# EAGLE design at32 (EAGLE 8.2.1)
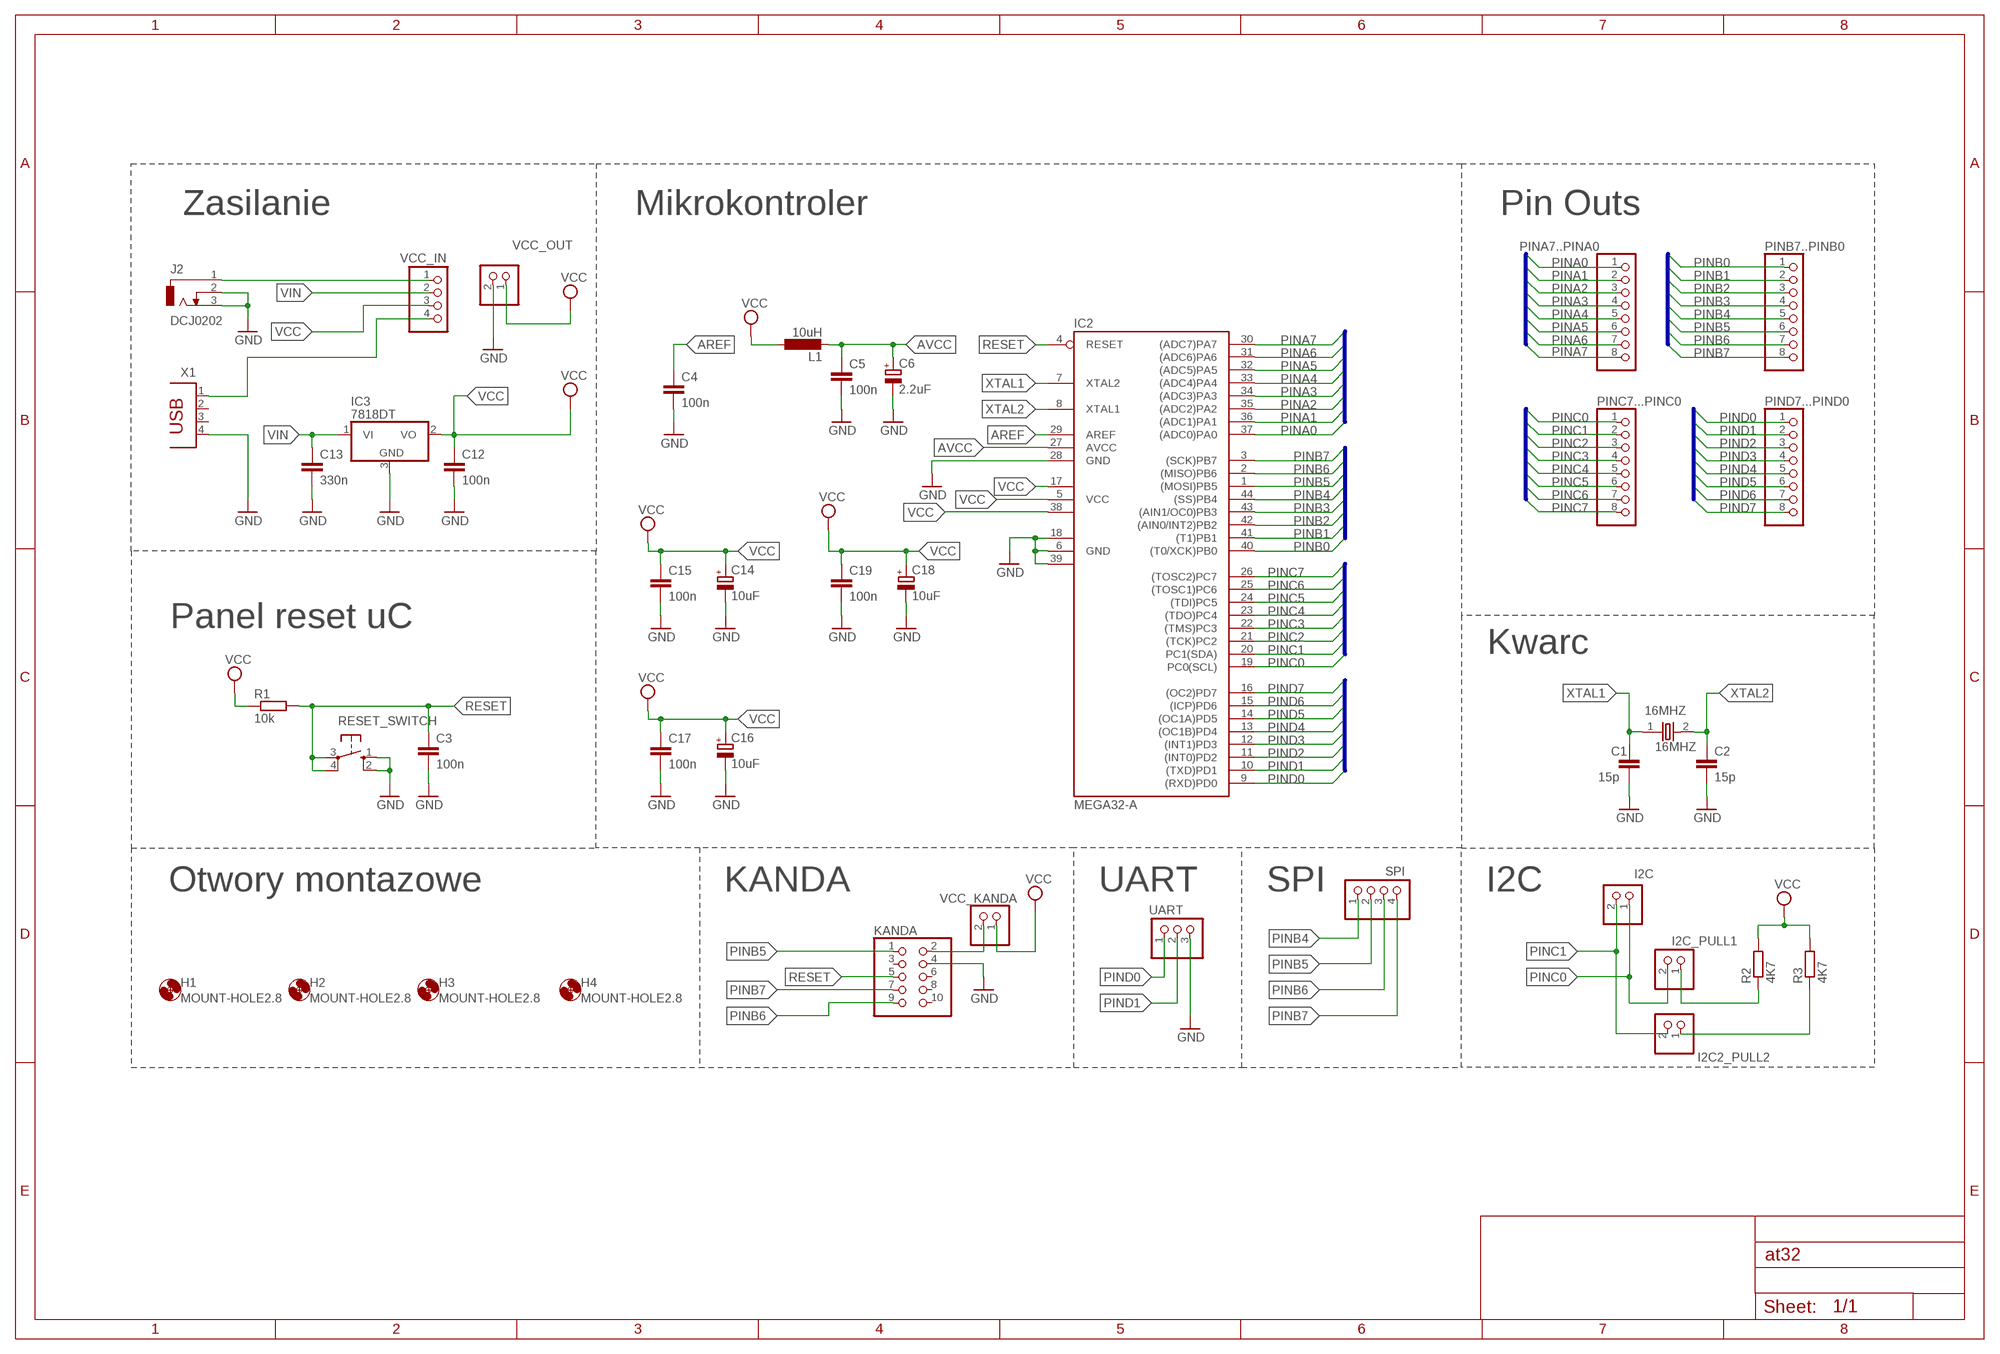
[diagram p0: schematic, sheet 1]

## Parts
16MHZ  16MHZ  [HC49SM]
C1  15p  C-EUC1206K  [C1206K]
C2  15p  C-EUC1206K  [C1206K]
C3  100n  C-EUC1206K  [C1206K]
C4  100n  C-EUC1206K  [C1206K]
C5  100n  C-EUC1206K  [C1206K]
C6  2.2uF  CPOL-EUA/3216-18W  [A/3216-18W]
C12  100n  C-EUC1206K  [C1206K]
C13  330n  C-EUC1206K  [C1206K]
C14  10uF  CPOL-EUA/3216-18W  [A/3216-18W]
C15  100n  C-EUC1206K  [C1206K]
C16  10uF  CPOL-EUA/3216-18W  [A/3216-18W]
C17  100n  C-EUC1206K  [C1206K]
C18  10uF  CPOL-EUA/3216-18W  [A/3216-18W]
C19  100n  C-EUC1206K  [C1206K]
H1  MOUNT-HOLE2.8  [2,8]
H2  MOUNT-HOLE2.8  [2,8]
H3  MOUNT-HOLE2.8  [2,8]
H4  MOUNT-HOLE2.8  [2,8]
I2C  PINHD-1X2  [1X02]
I2C2_PULL2  PINHD-1X2  [1X02]
I2C_PULL1  PINHD-1X2  [1X02]
IC2  MEGA32-A  [TQFP44]
IC3  7818DT  [TO252]
J2  DCJ0202  [DCJ0202]
KANDA  PINHD-2X5  [2X05]
L1  10uH  L-EUL3225M  [L3225M]
PINA7..PINA0  PINHD-1X8MAT8  [1X08]
PINB7..PINB0  PINHD-1X8MAT8  [1X08]
PINC7...PINC0  PINHD-1X8MAT8  [1X08]
PIND7...PIND0  PINHD-1X8MAT8  [1X08]
R1  10k  R-EU_R3216  [R3216]
R2  4K7  R-EU_R3216  [R3216]
R3  4K7  R-EU_R3216  [R3216]
RESET_SWITCH  10-XX  [B3F-10XX]
SPI  PINHD-1X4  [1X04]
UART  PINHD-1X3  [1X03]
VCC_IN  PINHD-1X4  [1X04]
VCC_KANDA  PINHD-1X2  [1X02]
VCC_OUT  PINHD-1X2  [1X02]
X1  PN87520  [PN87520]

## Nets
AREF: C4.1 IC2.29(AREF)
AVCC: C5.1 C6.+ IC2.27(AVCC) L1.2
GND: C1.2 C2.2 C3.2 C4.2 C5.2 C6.- C12.2 C13.2 C14.- C15.2 C16.- C17.2 C18.- C19.2 IC2.6(GND) IC2.18(GND1) IC2.28(GND) IC2.39(GND2) IC3.3(GND) J2.2 J2.3 KANDA.4 RESET_SWITCH.1(S) RESET_SWITCH.2(S1) UART.3 VCC_OUT.2 X1.4
N$1: I2C2_PULL2.1 R3.1
N$3: J2.1 VCC_IN.1
N$7: I2C_PULL1.1 R2.1
N$9: VCC_IN.4 X1.1
N$42: KANDA.2 VCC_KANDA.2
PINA0: IC2.37((ADC0)PA0) PINA7..PINA0.1
PINA1: IC2.36((ADC1)PA1) PINA7..PINA0.2
PINA2: IC2.35((ADC2)PA2) PINA7..PINA0.3
PINA3: IC2.34((ADC3)PA3) PINA7..PINA0.4
PINA4: IC2.33((ADC4)PA4) PINA7..PINA0.5
PINA5: IC2.32((ADC5)PA5) PINA7..PINA0.6
PINA6: IC2.31((ADC6)PA6) PINA7..PINA0.7
PINA7: IC2.30((ADC7)PA7) PINA7..PINA0.8
PINB0: IC2.40((T0/XCK)PB0) PINB7..PINB0.1
PINB1: IC2.41((T1)PB1) PINB7..PINB0.2
PINB2: IC2.42((AIN0/INT2)PB2) PINB7..PINB0.3
PINB3: IC2.43((AIN1/OC0)PB3) PINB7..PINB0.4
PINB4: IC2.44((SS)PB4) PINB7..PINB0.5 SPI.1
PINB5: IC2.1((MOSI)PB5) KANDA.1 PINB7..PINB0.6 SPI.2
PINB6: IC2.2((MISO)PB6) KANDA.9 PINB7..PINB0.7 SPI.3
PINB7: IC2.3((SCK)PB7) KANDA.7 PINB7..PINB0.8 SPI.4
PINC0: I2C.1 I2C_PULL1.2 IC2.19(PC0(SCL)) PINC7...PINC0.1
PINC1: I2C2_PULL2.2 I2C.2 IC2.20(PC1(SDA)) PINC7...PINC0.2
PINC2: IC2.21((TCK)PC2) PINC7...PINC0.3
PINC3: IC2.22((TMS)PC3) PINC7...PINC0.4
PINC4: IC2.23((TDO)PC4) PINC7...PINC0.5
PINC5: IC2.24((TDI)PC5) PINC7...PINC0.6
PINC6: IC2.25((TOSC1)PC6) PINC7...PINC0.7
PINC7: IC2.26((TOSC2)PC7) PINC7...PINC0.8
PIND0: IC2.9((RXD)PD0) PIND7...PIND0.1 UART.1
PIND1: IC2.10((TXD)PD1) PIND7...PIND0.2 UART.2
PIND2: IC2.11((INT0)PD2) PIND7...PIND0.3
PIND3: IC2.12((INT1)PD3) PIND7...PIND0.4
PIND4: IC2.13((OC1B)PD4) PIND7...PIND0.5
PIND5: IC2.14((OC1A)PD5) PIND7...PIND0.6
PIND6: IC2.15((ICP)PD6) PIND7...PIND0.7
PIND7: IC2.16((OC2)PD7) PIND7...PIND0.8
RESET: C3.1 IC2.4(RESET) KANDA.5 R1.2 RESET_SWITCH.3(P) RESET_SWITCH.4(P1)
VCC: C12.1 C14.+ C15.1 C16.+ C17.1 C18.+ C19.1 IC2.5(VCC) IC2.17(VCC1) IC2.38(VCC2) IC3.2(VO) L1.1 R1.1 R2.2 R3.2 VCC_IN.3 VCC_KANDA.1 VCC_OUT.1
VIN: C13.1 IC3.1(VI) VCC_IN.2
XTAL1: 16MHZ.1 C1.1 IC2.7(XTAL2)
XTAL2: 16MHZ.2 C2.1 IC2.8(XTAL1)
Unconnected: KANDA.3 KANDA.6 KANDA.8 KANDA.10 X1.2 X1.3

## Buses
PINB[0..7]
PINA[0..7]
PINC[0..7]
PIND[0..7]

## Notes on the sheet
- Zasilanie | Mikrokontroler | Pin Outs
- Panel reset uC
- Kwarc
- Otwory montazowe | KANDA | UART | SPI | I2C

## Library data of the parts
16MHZ = Inzynierka:16MHZ
C1-C5 C12 C13 C15 C17 C19 = rcl:C-EU: CAPACITOR, European symbol
C6 C14 C16 C18 = rcl:CPOL-EU: POLARIZED CAPACITOR, European symbol
H1-H4 = holes:MOUNT-HOLE: MOUNTING HOLE with drill center marker
I2C I2C2_PULL2 I2C_PULL1 VCC_KANDA VCC_OUT = pinheadMateusz_popr:PINHD-1X2: PIN HEADER
IC2 = atmel:MEGA32: MICROCONTROLLER 32 Kbytes FLASH 2 Kbytes SRAM 1 Kbytes EEPROM USART 8-channel 10 bit ADC Source: www.atmel.com .. doc2503.pdf; MPN: ATMEGA32-16AU; OC_FARNELL: 9171274; OC_NEWARK: 69K6677
IC3 = linear:78*: Positive VOLTAGE REGULATOR Source: http://cache.national.com/ds/LM/LM78L05.pdf http://www.fairchildsemi.com/ds/LM/LM7805.pdf
J2 = con-jackMAT:DCJ0202: DC POWER JACK Source: DCJ0202.pdf; OC_FARNELL: unknown; OC_NEWARK: unknown
KANDA = pinhead:PINHD-2X5: PIN HEADER
L1 = rcl:L-EU: INDUCTOR, European symbol
PINA7..PINA0 PINB7..PINB0 PINC7...PINC0 PIND7...PIND0 = pinheadMateusz_popr:PINHD-1X8: PIN HEADER
R1-R3 = rcl:R-EU_: RESISTOR, European symbol
RESET_SWITCH = switch-omron:10-XX: OMRON SWITCH; MPN: B3F-1000; OC_FARNELL: 176432; OC_NEWARK: 36M3542
SPI VCC_IN = pinheadMateusz_popr:PINHD-1X4: PIN HEADER
UART = pinheadMateusz_popr:PINHD-1X3: PIN HEADER
X1 = con-berg_poprw:PN87520: BERG USB connector; OC_FARNELL: unknown; OC_NEWARK: unknown

## Board
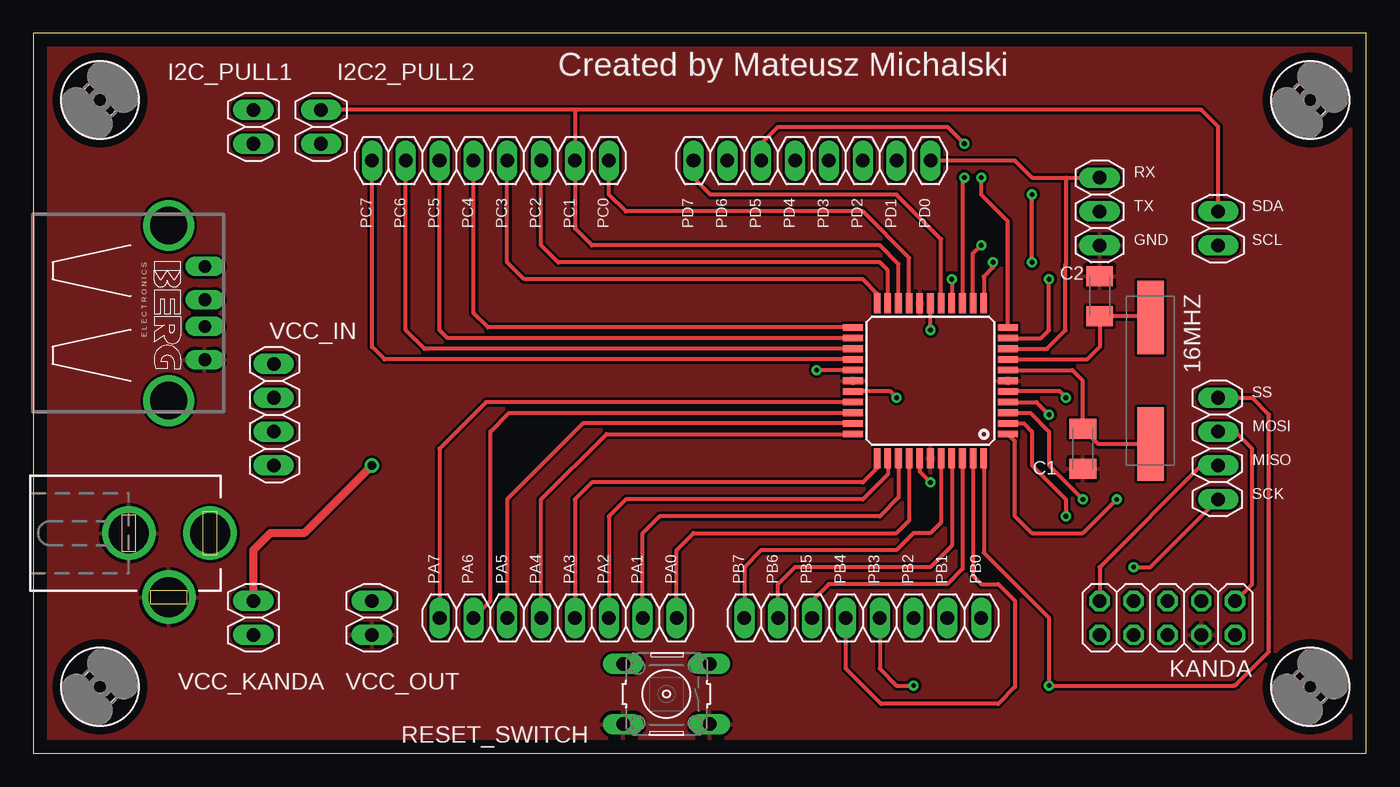
[diagram p1: board, top side]
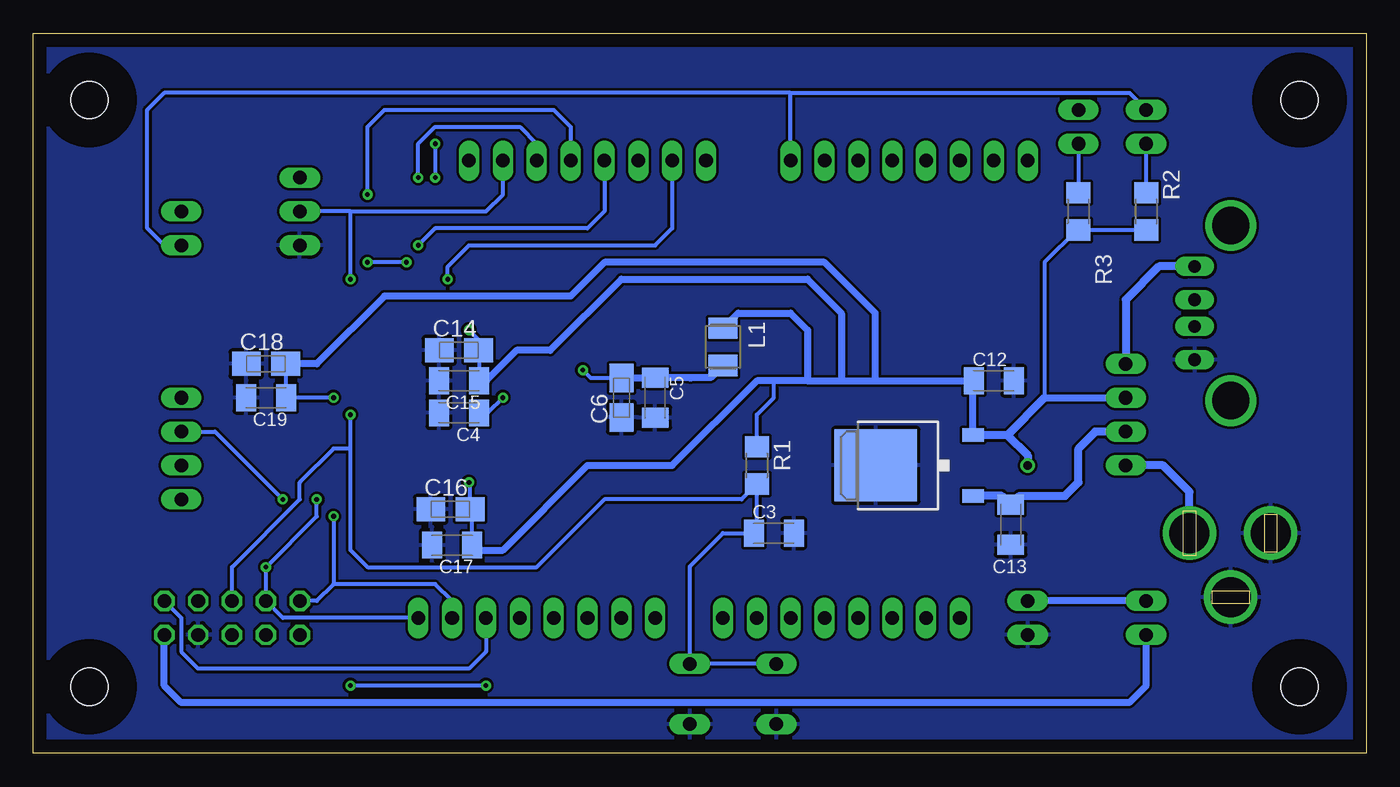
[diagram p2: board, bottom side, seen from below]

Size 100 x 54 mm. Coordinates in mm from the lower left corner, seen from the top.
Outline: 0,0 100,0 100,54 0,54 0,0
Copper layers (1*16): Top 0.035mm / dielectric 1.5mm / Bottom 0.035mm
Design rules "default *": minimum track width 8mil, minimum drill 0.35mm, track to track 8mil, track to pad 8mil, pad to pad 8mil, via to via 8mil, smd to smd 8mil, copper to edge 40mil, drill to drill 8mil, minimum pad ring 10mil, minimum via ring 8mil, stop-mask expansion 8mil, vias tented up to drill 0mil, thermal gap 10mil

### Footprints (pad centres in the part's own frame; a part is rotated, then mirrored left to right if it is on the bottom)
HC49SM = smd 5.5 x 2: 1 -4.75,0; 2 4.75,0
C1206K = smd 1.5 x 2: 1 -1.5,0; 2 1.5,0
A/3216-18W = smd 2.15 x 1.8: + 1.475,0; - -1.475,0
2,8 = hole 2.8: 0,0
1X02 = drill 1.016 long: 1 -1.27,0; 2 1.27,0
TQFP44 = smd 1.5 x 0.5: 1 -5.8,4; 2 -5.8,3.2; 3 -5.8,2.4; 4 -5.8,1.6; 5 -5.8,0.8; 6 -5.8,0; 7 -5.8,-0.8; 8 -5.8,-1.6; 9 -5.8,-2.4; 10 -5.8,-3.2; 11 -5.8,-4; 23 5.8,-4; 24 5.8,-3.2; 25 5.8,-2.4; 26 5.8,-1.6; 27 5.8,-0.8; 28 5.8,0; 29 5.8,0.8; 30 5.8,1.6; 31 5.8,2.4; 32 5.8,3.2; 33 5.8,4 | smd 0.5 x 1.5: 12 -4,-5.8; 13 -3.2,-5.8; 14 -2.4,-5.8; 15 -1.6,-5.8; 16 -0.8,-5.8; 17 0,-5.8; 18 0.8,-5.8; 19 1.6,-5.8; 20 2.4,-5.8; 21 3.2,-5.8; 22 4,-5.8; 34 4,5.8; 35 3.2,5.8; 36 2.4,5.8; 37 1.6,5.8; 38 0.8,5.8; 39 0,5.8; 40 -0.8,5.8; 41 -1.6,5.8; 42 -2.4,5.8; 43 -3.2,5.8; 44 -4,5.8
TO252 = smd 1 x 1.6: 1 -2.28,-4.8; 2 2.28,-4.8 | smd 5.4 x 6.2: 3 0,2.5
DCJ0202 = drill 3 pad 3.81: 1 0,3.1; 2 4.8,0; 3 0,-3
2X05 = drill 1.016 octagon: 1 -5.08,-1.27; 2 -5.08,1.27; 3 -2.54,-1.27; 4 -2.54,1.27; 5 0,-1.27; 6 0,1.27; 7 2.54,-1.27; 8 2.54,1.27; 9 5.08,-1.27; 10 5.08,1.27
L3225M = smd 1.6 x 2.2: 1 -1.4,0; 2 1.4,0
1X08 = drill 1.016 long: 1 -8.89,0; 2 -6.35,0; 3 -3.81,0; 4 -1.27,0; 5 1.27,0; 6 3.81,0; 7 6.35,0; 8 8.89,0
R3216 = smd 1.6 x 1.8: 1 -1.4,0; 2 1.4,0
B3F-10XX = drill 1.016 long: 1 -3.251,2.261; 2 3.251,2.261; 3 -3.251,-2.261; 4 3.251,-2.261
1X04 = drill 1.016 long: 1 -3.81,0; 2 -1.27,0; 3 1.27,0; 4 3.81,0
1X03 = drill 1.016 long: 1 -2.54,0; 2 0,0; 3 2.54,0
PN87520 = drill 0.95 long: 1 -3.5,2.71; 2 -1,2.71; 3 1,2.71; 4 3.5,2.71 | drill 2.8 pad 3.5: P$1 6.57,0; P$2 -6.57,0

### Placement (x,y rotation side)
16MHZ  83.82,27.94 90 top
C1  78.74,22.86 270 top
C2  80.01,34.29 90 top
C3  44.45,16.51 0 bottom
C4  68.07,25.53 180 bottom
C5  53.34,26.67 270 bottom
C6  55.88,26.67 90 bottom
C12  27.94,27.94 0 bottom
C13  26.67,17.14 270 bottom
C14  68.07,30.23 0 bottom
C15  68.07,27.94 180 bottom
C16  68.71,18.29 0 bottom
C17  68.58,15.62 180 bottom
C18  82.55,29.21 0 bottom
C19  82.55,26.67 180 bottom
H1  95.8,5 0 top
H2  95.8,49 0 top
H3  5,49 0 top
H4  5,5 0 top
I2C  88.9,39.37 90 top
I2C2_PULL2  21.59,46.99 90 top
I2C_PULL1  16.51,46.99 90 top
IC2  67.31,27.94 180 top
IC3  34.29,21.59 90 bottom
J2  10.16,16.51 270 top
KANDA  85.09,10.16 180 top
L1  48.26,30.48 270 bottom
PINA7..PINA0  39.37,10.16 180 top
PINB7..PINB0  62.23,10.16 0 top
PINC7...PINC0  34.29,44.45 180 top
PIND7...PIND0  58.42,44.45 180 top
R1  45.72,21.59 270 bottom
R2  16.51,40.64 270 bottom
R3  21.59,40.64 270 bottom
RESET_SWITCH  47.5,4.45 180 top
SPI  88.9,22.86 270 top
UART  80.01,40.64 270 top
VCC_IN  18.03,25.4 90 top
VCC_KANDA  16.51,10.16 270 top
VCC_OUT  25.4,10.16 270 top
X1  10.16,33.02 270 top

### Tracks (layer width: path | path; a pad name or v marks a point on that pad's centre or on a via)
AREF  (via drill 0.35)
  Top 0.305: v64.77,26.67 64.3,27.14 IC2.29
  Bottom 0.305: v64.77,26.67 65.91,25.53 C4.1
AVCC  (via drill 0.35)
  Top 0.305: IC2.27 v58.76,28.74
  Bottom 0.305: C6.+ 58.17,28.14 v58.76,28.74
  Bottom 0.508: C6.+ 55.85,28.17 C5.1 50.8,28.17 | 50.8,28.17 50.57,28.17 | L1.2 49.17,28.17 50.8,28.17
GND
  pour Top: -3.81,55.88 105.41,55.88 105.41,-6.35 -3.81,-6.35
  pour Bottom: -1.27,57.15 104.14,57.15 104.14,-5.08 -3.81,-5.08 -3.81,57.15
N$1
  Bottom 0.305: 21.72,42.04 R3.1 I2C2_PULL2.1
N$3
  Bottom 0.61: VCC_IN.1 15.24,21.59 13.26,19.61 J2.1
N$7
  Bottom 0.305: R2.1 I2C_PULL1.1
N$9
  Bottom 0.61: VCC_IN.4 18.03,34.04 15.55,36.52 X1.1
N$42
  Bottom 0.508: VCC_KANDA.2 16.51,5.08 17.78,3.81 88.9,3.81 90.17,5.08 KANDA.2
PINA0
  Top 0.305: IC2.37 65.71,17.45 64.77,16.51 49.53,16.51 48.26,15.24 PINA7..PINA0.1
PINA1
  Top 0.305: PINA7..PINA0.2 45.72,16.51 46.99,17.78 63.5,17.78 64.91,19.19 IC2.36
PINA2
  Top 0.305: IC2.35 64.11,20.93 62.23,19.05 44.45,19.05 43.18,17.78 PINA7..PINA0.3
PINA3
  Top 0.305: IC2.34 63.31,21.4 62.23,20.32 41.91,20.32 40.64,19.05 PINA7..PINA0.4
PINA4
  Top 0.305: PINA7..PINA0.5 38.1,19.05 42.99,23.94 IC2.33
PINA5
  Top 0.305: IC2.32 41.25,24.74 35.56,19.05 PINA7..PINA0.6
PINA6
  Top 0.305: PINA7..PINA0.7 34.29,11.43 34.29,24.13 35.7,25.54 IC2.31
PINA7
  Top 0.305: PINA7..PINA0.8 30.48,22.86 33.96,26.34 IC2.30
PINB0
  Top 0.305: 53.34,11.43 PINB7..PINB0.1 53.34,13.97 54.61,15.24 64.77,15.24 66.04,16.51 67.31,16.51 68.11,17.31 IC2.40
PINB1
  Top 0.305: PINB7..PINB0.2 55.88,12.7 57.15,13.97 67.31,13.97 68.91,15.57 IC2.41
PINB2
  Top 0.305: PINB7..PINB0.3 58.42,11.43 59.69,12.7 68.58,12.7 69.71,13.83 IC2.42
PINB3
  Top 0.305: IC2.43 70.51,13.31 71.12,12.7 72.39,12.7 73.66,11.43 73.66,4.98 72.39,3.71 63.6,3.71 60.96,6.35 PINB7..PINB0.4
PINB4  (via drill 0.35)
  Top 0.305: SPI.1 91.44,26.67 92.71,25.4 92.71,10.16 92.71,7.62 90.26,5.17 arc-45 90.04,5.08 v76.2,5.08 76.2,10.16 71.31,15.05 IC2.44 | 63.5,8.89 PINB7..PINB0.5 63.5,6.35 64.77,5.08 v66.04,5.08
  Bottom 0.305: v66.04,5.08 v76.2,5.08
PINB5  (via drill 0.35)
  Top 0.305: v81.28,19.05 78.74,16.51 74.93,16.51 73.66,17.78 73.66,23.39 IC2.1 | SPI.2 90.17,24.13 91.44,22.86 91.44,12.7 KANDA.1
  Bottom 0.305: SPI.2 86.36,24.13 v81.28,19.05 | PINB7..PINB0.6 66.04,7.62 67.31,6.35 87.63,6.35 88.9,7.62 88.9,10.16 KANDA.1
PINB6  (via drill 0.35)
  Top 0.305: KANDA.9 80.01,13.97 87.63,21.59 SPI.3 | IC2.2 74.32,24.74 74.93,24.13 74.93,21.59 77.47,19.05 v77.47,17.78
  Bottom 0.305: PINB7..PINB0.7 68.58,11.43 69.85,12.7 77.47,12.7 | KANDA.9 78.74,11.43 77.47,12.7 | v77.47,17.78 77.47,12.7
PINB7  (via drill 0.35)
  Top 0.305: IC2.3 74.79,25.54 76.2,24.13 76.2,21.59 v78.74,19.05 | v82.55,13.97 83.82,13.97 SPI.4
  Bottom 0.305: v78.74,19.05 78.74,17.78 v82.55,13.97 KANDA.7 81.28,10.16 PINB7..PINB0.8
PINC0
  Top 0.305: IC2.19 65.71,37.16 62.23,40.64 44.45,40.64 43.18,41.91 PINC7...PINC0.1
  Bottom 0.305: I2C.1 90.17,38.1 91.44,39.37 91.44,48.26 90.17,49.53 43.18,49.53 | 43.18,49.53 17.78,49.53 I2C_PULL1.2 | PINC7...PINC0.1 43.18,49.53
PINC1
  Top 0.305: IC2.20 64.91,36.69 63.5,38.1 41.91,38.1 40.64,39.37 PINC7...PINC0.2 40.64,48.26 | 40.64,48.26 I2C2_PULL2.2 | I2C.2 88.9,46.99 87.63,48.26 40.64,48.26
PINC2
  Top 0.305: IC2.21 64.11,36.22 63.5,36.83 39.37,36.83 38.1,38.1 PINC7...PINC0.3
PINC3
  Top 0.305: IC2.22 63.31,34.48 62.23,35.56 36.83,35.56 35.56,36.83 PINC7...PINC0.4
PINC4
  Top 0.305: IC2.23 34.1,31.94 33.02,33.02 PINC7...PINC0.5
PINC5
  Top 0.305: IC2.24 31.09,31.14 30.48,31.75 PINC7...PINC0.6
PINC6
  Top 0.305: IC2.25 29.35,30.34 27.94,31.75 PINC7...PINC0.7
PINC7
  Top 0.305: IC2.26 26.34,29.54 25.4,30.48 PINC7...PINC0.8
PIND0
  Top 0.305: 77.47,43.18 74.93,43.18 73.66,44.45 PIND7...PIND0.1 | 77.47,43.18 UART.1 | 77.47,43.18 77.47,36.7 77.44,36.67 77.44,31.71 76.06,30.34 IC2.9
PIND1  (via drill 0.35)
  Top 0.305: IC2.10 75.59,31.14 76.2,31.75 v76.2,35.56
  Bottom 0.305: 76.2,40.64 66.04,40.64 64.77,41.91 PIND7...PIND0.2 | 76.2,40.64 UART.2 | v76.2,35.56 76.2,40.64
PIND2  (via drill 0.35)
  Top 0.305: IC2.11 73.11,39.92 71.12,41.91 v71.12,43.18
  Bottom 0.305: v71.12,43.18 71.12,45.72 69.85,46.99 63.5,46.99 62.23,45.72 PIND7...PIND0.3
PIND3  (via drill 0.35)
  Top 0.305: IC2.12 71.31,35.75 72.01,36.45 v72.01,36.83 | v74.93,36.83 v74.93,41.91
  Bottom 0.305: PIND7...PIND0.4 59.69,46.99 60.96,48.26 73.66,48.26 74.93,46.99 v74.93,41.91 | v72.01,36.83 v74.93,36.83
PIND4  (via drill 0.35)
  Top 0.305: IC2.13 70.51,37.49 v71.12,38.1
  Bottom 0.305: PIND7...PIND0.5 57.15,40.64 58.42,39.37 69.85,39.37 v71.12,38.1
PIND5  (via drill 0.35)
  Top 0.305: v69.85,45.72 68.58,46.99 55.88,46.99 54.61,45.72 PIND7...PIND0.6 | v69.85,43.18 arc90 69.71,43.04 IC2.14
  Bottom 0.305: v69.85,45.72 v69.85,43.18
PIND6  (via drill 0.35)
  Top 0.305: v68.91,35.56 IC2.15
  Bottom 0.305: PIND7...PIND0.7 52.07,39.37 53.34,38.1 67.31,38.1 68.91,36.5 v68.91,35.56
PIND7
  Top 0.305: IC2.16 68.11,38.57 64.77,41.91 50.8,41.91 49.53,43.18 PIND7...PIND0.8
RESET  (via drill 0.35)
  Top 0.305: IC2.4 75.26,26.34 v76.2,25.4
  Bottom 0.305: 76.2,22.86 76.2,15.24 74.93,13.97 62.23,13.97 57.15,19.05 46.86,19.05 R1.2 45.72,16.74 C3.1 48.26,16.51 50.75,14.02 RESET_SWITCH.3 | 76.2,22.86 v76.2,25.4 | RESET_SWITCH.4 RESET_SWITCH.3 | 76.2,22.86 77.47,22.86 80.01,20.32 80.01,19.05 85.09,13.97 KANDA.5 | RESET_SWITCH.3 50.8,6.76
VCC  (via drill 0.35, 0.65)
  Top 0.305: v67.31,31.75 IC2.17 | v77.47,26.67 77,27.14 IC2.5 | v67.31,20.32 66.51,21.12 IC2.38
  Top 0.61: v25.4,21.59 20.32,16.51 17.78,16.51 16.51,15.24 VCC_KANDA.1
  Bottom 0.305: C15.1 66.57,30.23 C14.+ 66.6,31.04 v67.31,31.75 | R2.2 R3.2 21.72,39.24 24.13,36.83 24.13,26.67 | C18.+ 81.08,26.7 C19.1 v77.47,26.67 | R1.1 45.72,25.4 44.45,26.67 44.45,27.94 | v67.31,20.32 67.23,20.24 C16.+ 67.08,18.14 C17.1
  Bottom 0.508: 24.13,26.67 VCC_IN.3 | 66.04,27.94 63.75,30.23 61.21,30.23 55.88,35.56 41.91,35.56 39.37,33.02 39.37,27.94 | C18.+ 78.74,29.21 73.66,34.29 59.69,34.29 57.15,36.83 40.64,36.83 36.83,33.02 36.83,27.94 | C17.1 66.7,15.24 64.77,15.24 58.42,21.59 52.07,21.59 45.72,27.94 44.45,27.94 41.91,27.94 | IC3.2 29.49,27.89 | 41.91,27.94 39.37,27.94 | 39.37,27.94 36.83,27.94 | 36.83,27.94 C12.1 | 41.91,27.94 41.91,31.75 43.18,33.02 47.12,33.02 L1.1 | VCC_KANDA.1 VCC_OUT.1
  Bottom 0.61: 26.93,23.87 IC3.2 | 26.93,23.87 24.13,26.67 | 29.49,27.89 C12.1 | 26.93,23.87 25.4,22.34 v25.4,21.59 | C15.1 66.04,27.94
VIN
  Bottom 0.61: VCC_IN.2 20.32,24.13 21.59,22.86 21.59,20.32 22.6,19.31 26,19.31 C13.1 27.34,19.31 IC3.1
XTAL1
  Top 0.305: IC2.7 77.94,28.74 78.74,27.94 C1.1 79.91,23.19 16MHZ.1
XTAL2
  Top 0.305: IC2.8 79.07,29.54 80.01,30.48 C2.1 83.72,32.79 16MHZ.2

### Text on the board
tNames: Created by Mateusz Michalski | RX | TX | SDA | PC7 | PC6 | PC5 | PC4 | PC3 | PC2 | PC1 | PC0 | PD7 | PD6 | PD5 | PD4 | PD3 | PD2 | PD1 | PD0 | GND | SCL | SS | MOSI | MISO | SCK | PA7 | PA6 | PA5 | PA4 | PA3 | PA2 | PA1 | PA0 | PB7 | PB6 | PB5 | PB4 | PB3 | PB2 | PB1 | PB0